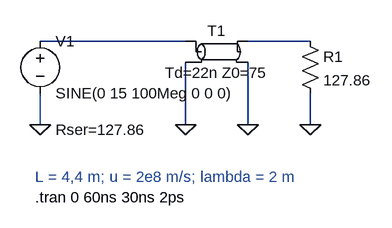
[diagram p0: schematic Q2b_v2.asc]
Q2b_v2.asc, the LTspice schematic file:
Version 4
SHEET 1 880 700
WIRE 96 128 -128 128
WIRE 288 128 192 128
WIRE -128 256 -128 208
WIRE 96 256 96 160
WIRE 192 256 192 160
WIRE 288 256 288 208
FLAG -128 256 0
FLAG 96 256 0
FLAG 192 256 0
FLAG 288 256 0
SYMBOL tline 144 144 R0
SYMATTR InstName T1
SYMATTR Value Td=22n Z0=75
SYMBOL res 272 112 R0
SYMATTR InstName R1
SYMATTR Value 127.86
SYMBOL voltage -128 112 R0
WINDOW 123 24 124 Left 2
WINDOW 39 24 152 Left 2
SYMATTR SpiceLine Rser=127.86
SYMATTR InstName V1
SYMATTR Value SINE(0 15 100Meg 0 0 0)
TEXT -136 336 Left 2 ;L = 4,4 m; u = 2e8 m/s; lambda = 2 m
TEXT -136 368 Left 2 !.tran 0 60ns 30ns 2ps

The netlist it stands for:
* Q2b_v2.asc
T1 N001 0 N002 0 Td=22n Z0=75
R1 N002 0 127.86
V1 N001 0 SINE(0 15 100Meg 0 0 0) Rser=127.86
* L = 4,4 m; u = 2e8 m/s; lambda = 2 m
.tran 0 60ns 30ns 2ps
.backanno
.end